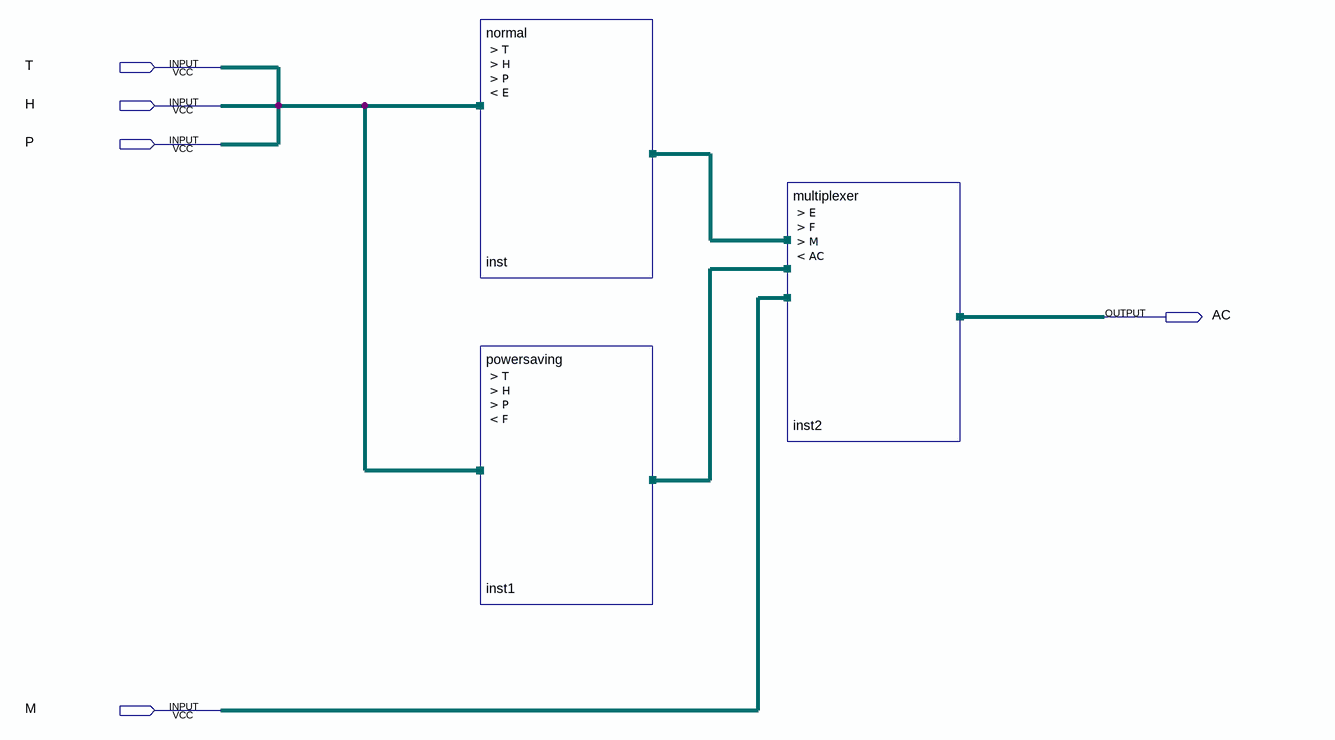
[diagram p0: schematic sheet]
// Quartus schematic lab4step2.bdf as structural Verilog: 3 symbols, 5 pins
module lab4step2 (
  input  T,
  input  H,
  input  P,
  input  M,
  output AC
);

  wire E, F;

  normal inst (.T(T), .H(H), .P(P), .E(E));
  powersaving inst1 (.T(T), .H(H), .P(P), .F(F));
  multiplexer inst2 (.E(E), .F(F), .M(M), .AC(AC));
endmodule
